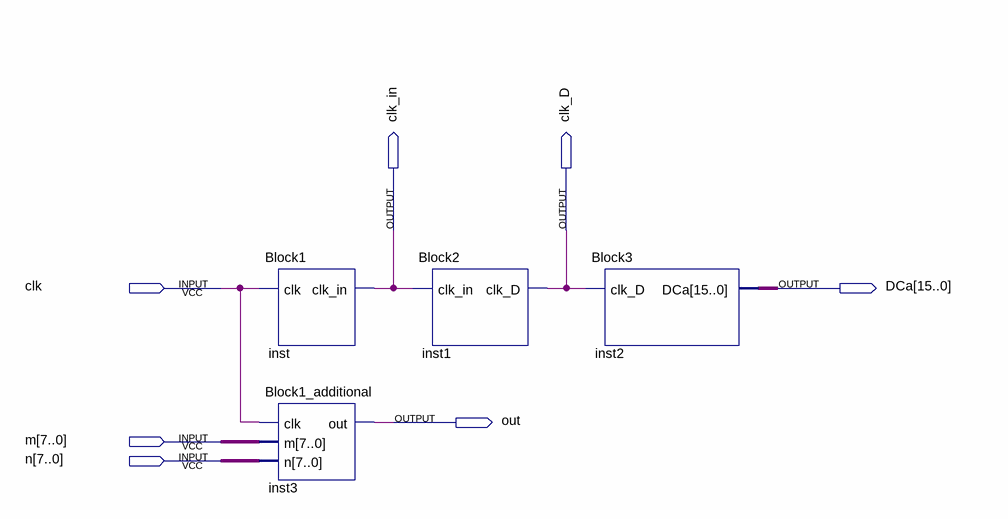
[diagram p0: schematic sheet]
// Quartus schematic main.bdf as structural Verilog: 4 symbols, 7 pins
module main (
  input  clk,
  input  [7:0] m,
  input  [7:0] n,
  output clk_in,
  output clk_D,
  output [15:0] DCa,
  output out
);

  Block1 inst (.clk(clk), .clk_in(clk_in));
  Block1_additional inst3 (.clk(clk), .m(m), .n(n), .out(out));
  Block2 inst1 (.clk_in(clk_in), .clk_D(clk_D));
  Block3 inst2 (.clk_D(clk_D), .DCa(DCa));
endmodule
